# Altium schematic sheet subckt_6V0_SMPS.SchDoc: SMPS 6V0
size A3; DocumentNumber: 8; Revision: 0; SheetNumber: 8; SheetTotal: 19
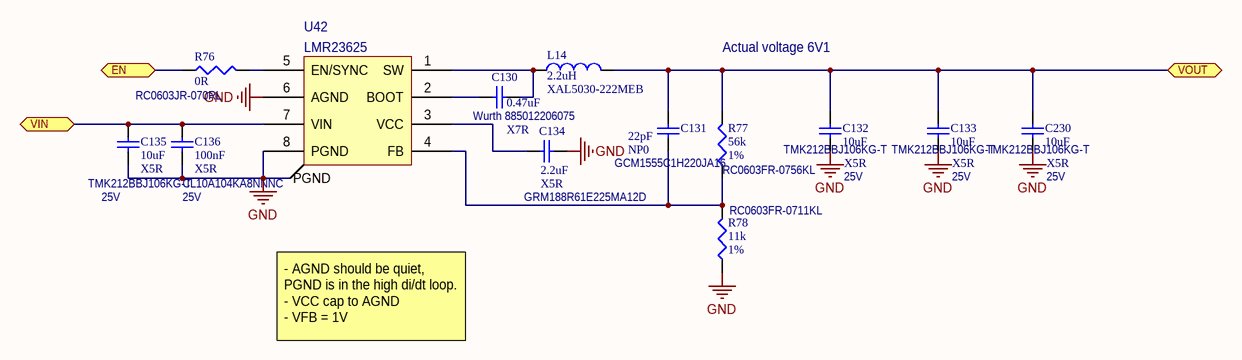
[diagram p0: subckt_6V0_SMPS.SchDoc]

## Parts
C130  value 0.47uF  Dielectric: X7R  Model: Wurth 885012206075  [CAP0603]
C131  value 22pF  Dielectric: NP0  Model: GCM1555C1H220JA16  [CAP0402]  (hidden comment: Capacitor)
C132  value 10uF  Dielectric: X5R  Model: TMK212BBJ106KG-T  Voltage: 25V  [CAP0805]  (hidden comment: Capacitor)
C133  value 10uF  Dielectric: X5R  Model: TMK212BBJ106KG-T  Voltage: 25V  [CAP0805]  (hidden comment: Capacitor)
C134  value 2.2uF  Dielectric: X5R  Model: GRM188R61E225MA12D  [CAP0603]
C135  value 10uF  Dielectric: X5R  Model: TMK212BBJ106KG-T  Voltage: 25V  [CAP0805]  (hidden comment: Capacitor)
C136  value 100nF  Dielectric: X5R  Model: CL10A104KA8NNNC  Voltage: 25V  [CAP0603]  (hidden comment: Capacitor)
C230  value 10uF  Dielectric: X5R  Model: TMK212BBJ106KG-T  Voltage: 25V  [CAP0805]  (hidden comment: Capacitor)
L14  value 2.2uH  Model: XAL5030-222MEB  [IND XAL50]  (hidden comment: >2A)
R76  value 0R  Model: RC0603JR-070RL  [RES0603]  (hidden comment: Resistor)
R77  value 56k  Type: 1%  Model: RC0603FR-0756KL  [RES0603]  (hidden comment: Resistor)
R78  value 11k  Type: 1%  Model: RC0603FR-0711KL  [RES0603]  (hidden comment: Resistor)
U42  LMR23625  [SOIC8 Thermal Pad]

## Ports
EN, VIN, VOUT

## Nets
GND: C132.1 C133.1 C134.2 C135.1 C136.1 C230.1 R78.1 U42.6(AGND) U42.8(PGND) U42.9(PGND)
EN: R76.1 ; port EN
VIN: C135.2 C136.2 U42.7(VIN) ; port VIN
VOUT: C131.1 C132.2 C133.2 C230.2 L14.2 R77.2 ; port VOUT
NetC130_1: C130.1 L14.1 U42.1(SW)
NetC130_2: C130.2 U42.2(BOOT)
NetC131_2: C131.2 R77.1 R78.2 U42.4(FB)
NetC134_1: C134.1 U42.3(VCC)
NetR76_2: R76.2 U42.5(EN/SYNC)

## Notes on the sheet
- Actual voltage 6V1
- - AGND should be quiet, PGND is in the high di/dt loop.
  - VCC cap to AGND
  - VFB = 1V

## Library data of the parts
C130 C134 = Capacitor
L14 = Inductor
U42 = LMR23625: 2.5A Simple Switcher sync buck
R76-R78 = Resistor
  R76: Type: *